# Altium schematic sheet AIRLIFT.SchDoc
size A; SheetNumber: 3; SheetTotal: 9
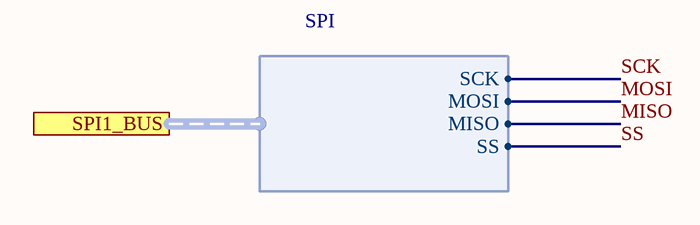
[diagram p0: AIRLIFT.SchDoc]

## Ports
SPI1_BUS (harness SPI)

## Harnesses
SPI: SCK, MOSI, MISO, SS

## Nets
MISO: port SPI1_BUS.MISO
MOSI: port SPI1_BUS.MOSI
SCK: port SPI1_BUS.SCK
SS: port SPI1_BUS.SS